# Altium schematic sheet RIAA.SchDoc
size A3
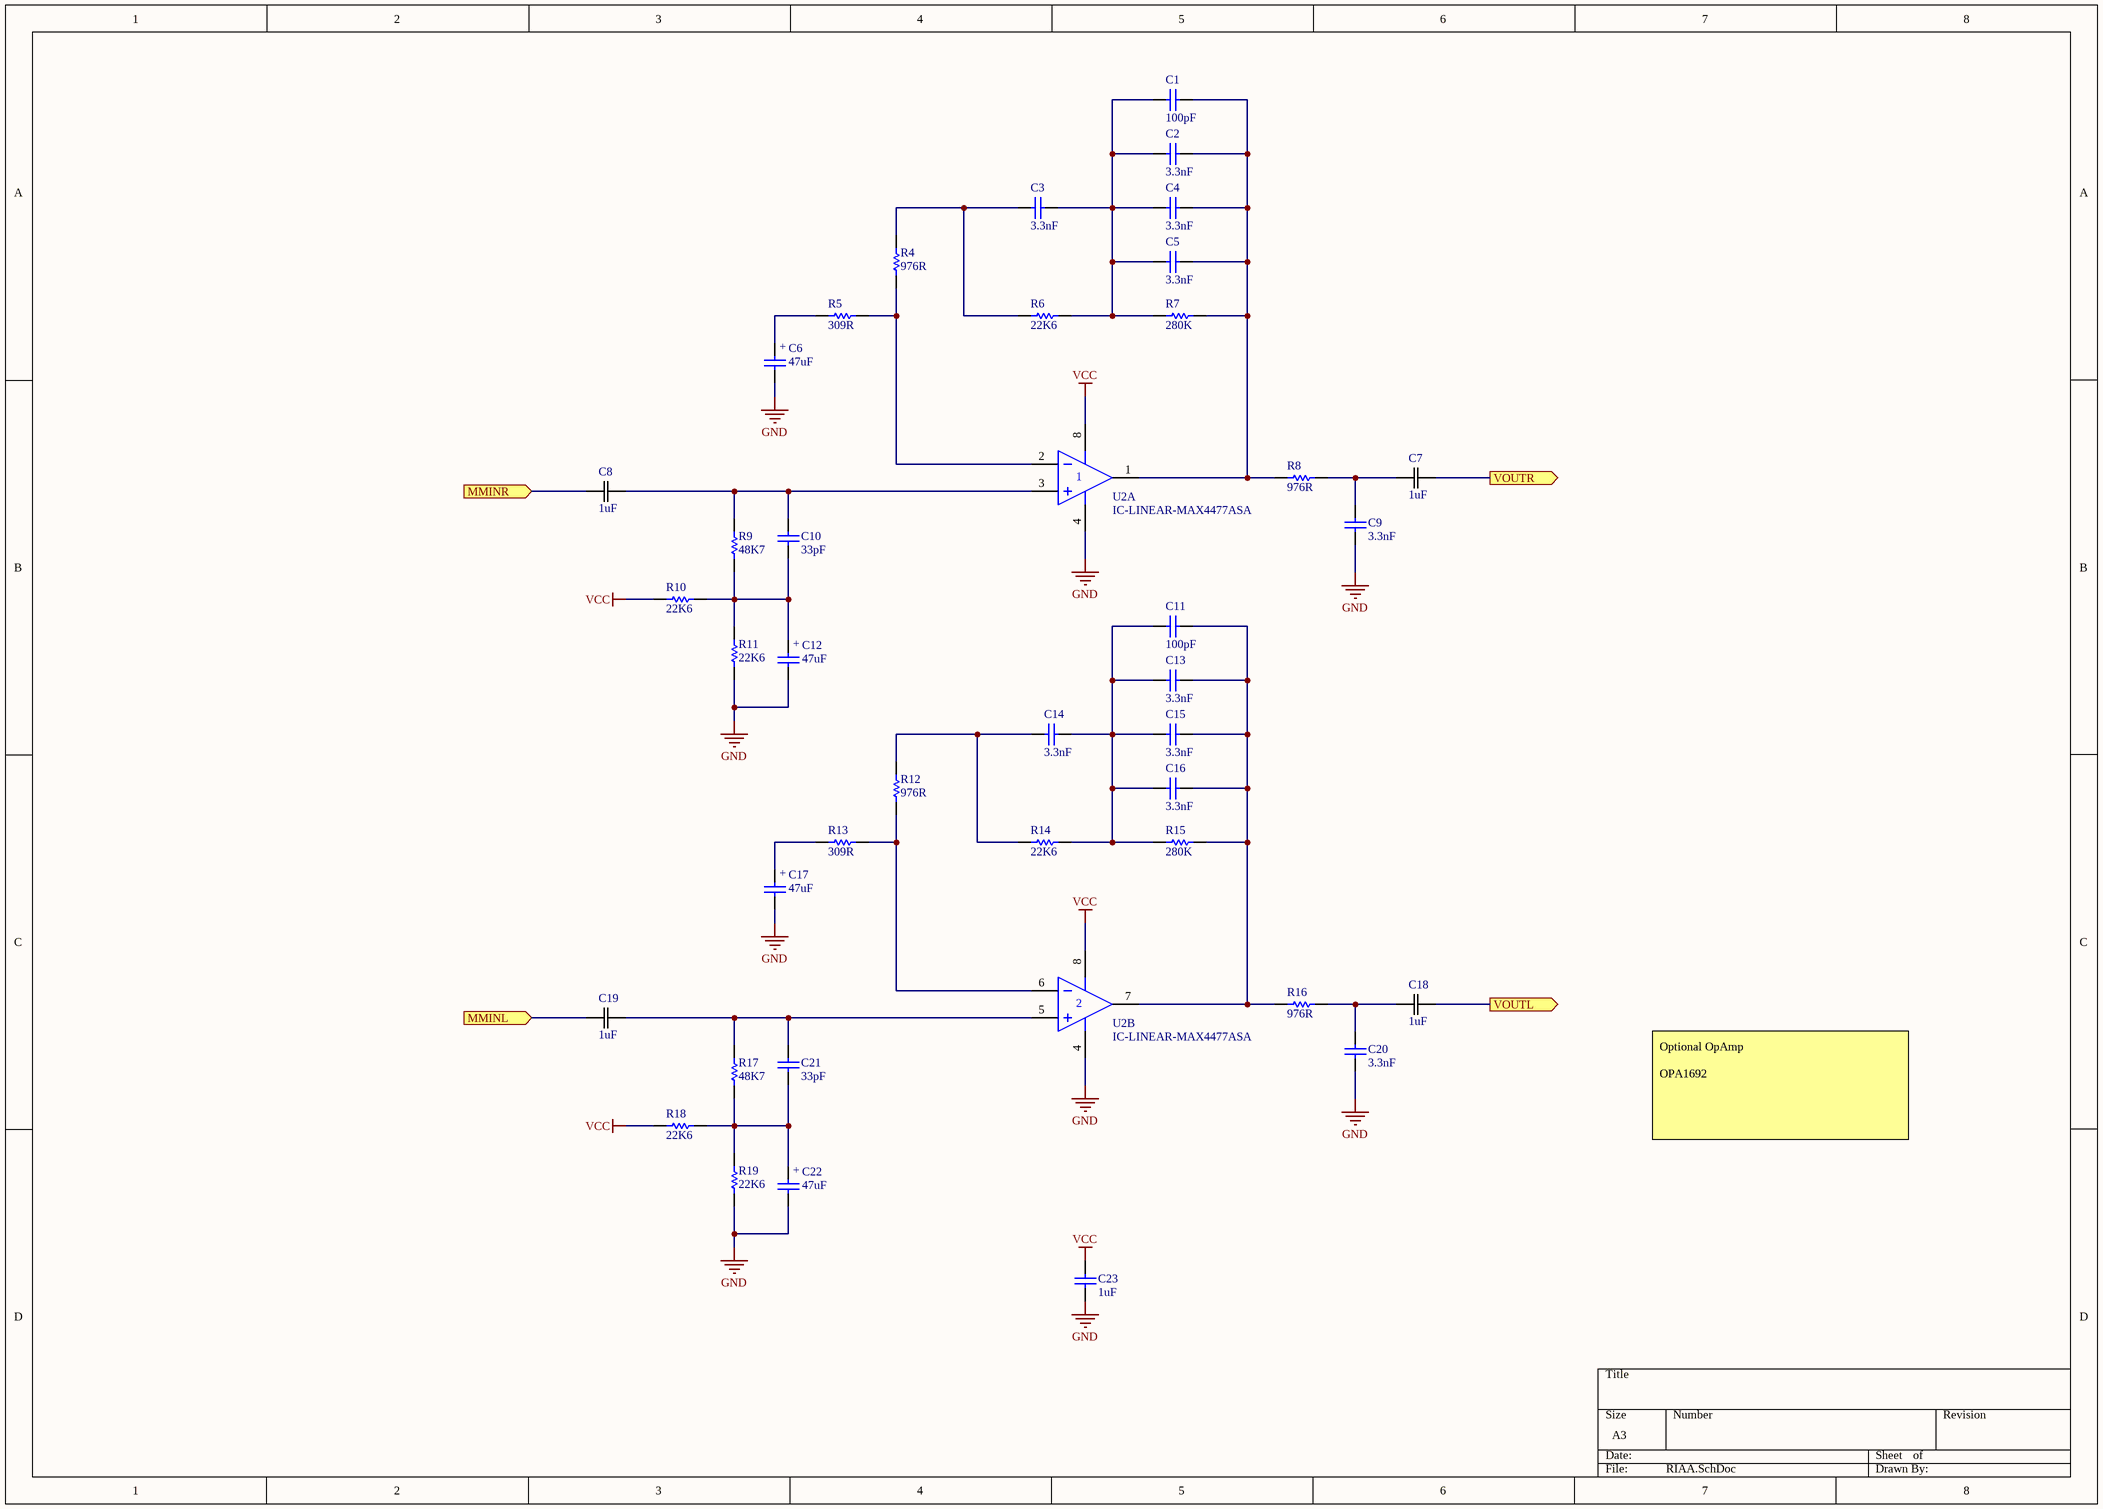
[diagram p0: RIAA.SchDoc]

## Parts
C1  value 100pF  [CAPC0402(1005)33_L]  (hidden comment: 0402CG101J500NT)
C2  value 3.3nF  [CAPC0603(1608)55_L]  (hidden comment: CL10C332JB8NFNC)
C3  value 3.3nF  [CAPC0603(1608)55_L]  (hidden comment: CL10C332JB8NFNC)
C4  value 3.3nF  [CAPC0603(1608)55_L]  (hidden comment: CL10C332JB8NFNC)
C5  value 3.3nF  [CAPC0603(1608)55_L]  (hidden comment: CL10C332JB8NFNC)
C6  value 47uF  [CAPPM3216X180N]  (hidden comment: TAJA476K006RNJ)
C7  1uF  [CAP_ECPU_G2]
C8  1uF  [CAP_ECPU_G2]
C9  value 3.3nF  [CAPC0603(1608)55_L]  (hidden comment: CL10C332JB8NFNC)
C10  value 33pF  [CAPC0402(1005)33_L]  (hidden comment: CC0402JRNPO9BN330)
C11  value 100pF  [CAPC0402(1005)33_L]  (hidden comment: 0402CG101J500NT)
C12  value 47uF  [CAPPM3216X180N]  (hidden comment: TAJA476K006RNJ)
C13  value 3.3nF  [CAPC0603(1608)55_L]  (hidden comment: CL10C332JB8NFNC)
C14  value 3.3nF  [CAPC0603(1608)55_L]  (hidden comment: CL10C332JB8NFNC)
C15  value 3.3nF  [CAPC0603(1608)55_L]  (hidden comment: CL10C332JB8NFNC)
C16  value 3.3nF  [CAPC0603(1608)55_L]  (hidden comment: CL10C332JB8NFNC)
C17  value 47uF  [CAPPM3216X180N]  (hidden comment: TAJA476K006RNJ)
C18  1uF  [CAP_ECPU_G2]
C19  1uF  [CAP_ECPU_G2]
C20  value 3.3nF  [CAPC0603(1608)55_L]  (hidden comment: CL10C332JB8NFNC)
C21  value 33pF  [CAPC0402(1005)33_L]  (hidden comment: CC0402JRNPO9BN330)
C22  value 47uF  [CAPPM3216X180N]  (hidden comment: TAJA476K006RNJ)
C23  value 1uF  [CAPC0402(1005)33_L]  (hidden comment: GRM155R61C105KA12D)
R4  976R  [RESC0402(1005)_L]
R5  309R  [RESC0402(1005)_L]
R6  22K6  [RESC0402(1005)_L]
R7  280K  [RESC0402(1005)_L]
R8  976R  [RESC0402(1005)_L]
R9  48K7  [RESC0402(1005)_L]
R10  22K6  [RESC0402(1005)_L]
R11  22K6  [RESC0402(1005)_L]
R12  976R  [RESC0402(1005)_L]
R13  309R  [RESC0402(1005)_L]
R14  22K6  [RESC0402(1005)_L]
R15  280K  [RESC0402(1005)_L]
R16  976R  [RESC0402(1005)_L]
R17  48K7  [RESC0402(1005)_L]
R18  22K6  [RESC0402(1005)_L]
R19  22K6  [RESC0402(1005)_L]
U2  IC-LINEAR-MAX4477ASA  [SOIC8_N]  (parts A,B of 2)

## Ports
MMINL (in), MMINR (in), VOUTL (out), VOUTR (out)

## Nets
GND: C6.2 C9.1 C12.2 C17.2 C20.1 C22.2 C23.1 R11.2 R19.2 U2.4(V-)
VCC: C23.2 R10.1 R18.1 U2.8(V+)
MMINL: C19.1 ; port MMINL
MMINR: C8.1 ; port MMINR
VOUTL: C18.2 ; port VOUTL
VOUTR: C7.2 ; port VOUTR
NetC1_1: C1.1 C2.1 C3.2 C4.1 C5.1 R6.2 R7.1
NetC1_2: C1.2 C2.2 C4.2 C5.2 R7.2 R8.1 U2.1(OUT1)
NetC3_1: C3.1 R4.1 R6.1
NetC6_1: C6.1 R5.1
NetC7_1: C7.1 C9.2 R8.2
NetC8_2: C8.2 C10.1 R9.1 U2.3(IN1+)
NetC10_2: C10.2 C12.1 R9.2 R10.2 R11.1
NetC11_1: C11.1 C13.1 C14.2 C15.1 C16.1 R14.2 R15.1
NetC11_2: C11.2 C13.2 C15.2 C16.2 R15.2 R16.1 U2.7(OUT2)
NetC14_1: C14.1 R12.1 R14.1
NetC17_1: C17.1 R13.1
NetC18_1: C18.1 C20.2 R16.2
NetC19_2: C19.2 C21.1 R17.1 U2.5(IN2+)
NetC21_2: C21.2 C22.1 R17.2 R18.2 R19.1
NetR4_2: R4.2 R5.2 U2.2(IN1-)
NetR12_2: R12.2 R13.2 U2.6(IN2-)

## Notes on the sheet
- Optional OpAmp
  OPA1692
- (in symbol CAP_47uF_6.3V_1206) +

## Library data of the parts
C1 C11 = CAP_100pF_0402: 0402 100pF ±5% 50V C0G，NP0; Dielectric: C0G; PackageReference: 0402; MPN: 0402CG101J500NT; Voltage: 50V
C2-C5 C9 C13-C16 C20 = CAP_3.3nF_0603: 0603 3.3nF ±5% 50V C0G(NPO) H=0.8mm; PackageReference: 0603; MPN: CL10C332JB8NFNC; Voltage: 50V; Dielectric: C0G
C6 C12 C17 C22 = CAP_47uF_6.3V_1206: 47µF ±10% 6.3V ESR=1.6Ω@100kHz; Dielectric: Tantalum; PackageReference: 1206; MPN: TAJA476K006RNJ; Voltage: 6.3V
C7 C8 C18 C19 = CAP-ECP-U1C105MA5: 1µF Film Capacitor  16V Acrylic, Metallized - Stacked 1210 (3225 Metric); Vendor: Panasonic; Built_By: EMA_UL_Team; Type: DEV; C: Copyright (C) 2015 Accelerated Designs. All rights reserved; MPN: ECP-U1C105MA5; RefDes: RefDes; Value: 1uF
C10 C21 = CAP_33pF_0402: 0402 33PF ±5% 50V NPO; Dielectric: C0G; PackageReference: 0402; MPN: CC0402JRNPO9BN330; Voltage: 50V
C23 = CAP_1uF_0402: 0402 1μF ±10% 16V X5R; Voltage: 10V; PackageReference: 0402; MPN: GRM155R61C105KA12D; Dielectric: X5R
R4 R8 R12 R16 = RES_976R_0402: 0402 976Ω ±1% 1/16W; MPN: 0402WGF9760TCE; Power: 62.5mW; Tolerance: 1%; Value: 976R
R5 R13 = RES_309R_0402: 0402 309Ω ±1% 1/16W; MPN: 0402WGF3090TCE; Power: 62.5mW; Tolerance: 1%; Value: 309R
R6 R10 R11 R14 R18 R19 = RES_22K6_0402: 0402 22.6KΩ ±1% 1/16W; MPN: RC0402FR-0722K6L; Power: 62.5mW; Tolerance: 1%; Value: 22K6
R7 R15 = RES_280K_0402: 0402 280KΩ ±1% 1/16W; MPN: 0402WGF2803TCE; Power: 62.5mW; Tolerance: 1%; Value: 280K
R9 R17 = RES_48K7_0402: 0402 48.7KΩ ±1% 1/16W; MPN: 0402WGF4872TCE; Power: 62.5mW; Tolerance: 1%; Value: 48K7
U2 = IC-LINEAR-MAX4477ASA: Dual Rail-to-Rail output  Low-Power Operational Amplifier; MPN: MAX4477ASA+; Farnell: 1550527